# Altium schematic sheet PL2303 USB-COM.SchDoc: PL2303 USB-COM
size A4; DrawnBy: Pavel Nadein; DocumentName: PL2303 USB-COM
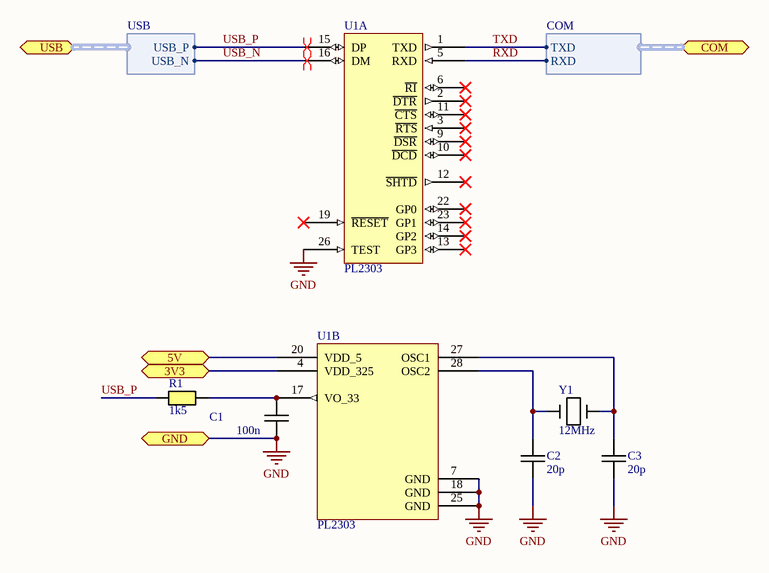
[diagram p0: PL2303 USB-COM.SchDoc]

## Parts
C1  100n  [CAPC0603(1608)55_N]
C2  20p  [CAPC0603(1608)55_N]
C3  20p  [CAPC0603(1608)55_N]
R1  1k5  [RESC0603(1608)_N]
U1  PL2303  [SSOP28]  (parts A,B of 2)
Y1  12MHz  [HC49 Crystal]

## Ports
3V3, 5V, COM (harness COM), GND, USB (harness USB)

## Harnesses
USB: USB_N, USB_P
COM: TXD, RXD

## Nets
GND: C1.2 C2.2 C3.2 U1.7(GND) U1.18(GND) U1.25(GND) U1.26(TEST) Y1.2 Y1.4 ; port GND
3V3: U1.4(VDD_325) ; port 3V3
5V: U1.20(VDD_5) ; port 5V
RXD: U1.5(RXD) ; port COM.RXD
TXD: U1.1(TXD) ; port COM.TXD
USB_N: U1.16(DM)
USB_P: R1.1 U1.15(DP) ; port USB.USB_P
NetC1_1: C1.1 R1.2 U1.17(VO_33)
NetC2_1: C2.1 U1.28(OSC2) Y1.1
NetC3_1: C3.1 U1.27(OSC1) Y1.3

Not connected (* = marked no-connect by the designer): U1 2(~{DTR})* 3(~{RTS})* 6(~{RI})* 9(~{DSR})* 10(~{DCD})* 11(~{CTS})* 12(~{SHTD})* 13(GP3)* 14(GP2)* 19(~{RESET})* 22(GP0)* 23(GP1)*

## Layout directives
differential pair: USB_N, USB_P

## Library data of the parts
C1-C3 = Capacitor M: Ceramic capacitor Medium density
  C1: Value: 100n
  C2 C3: Value: 20p
R1 = Resistor M: Resistor Medium Density; Value: 1k5
U1 = PL2303: USB to Serial Bridge Controller
Y1 = CRYSTAL: Value: 12MHz